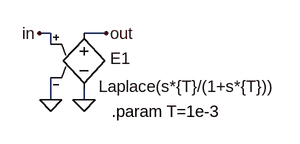
[diagram p0: schematic DifDelay.asc]
DifDelay.asc, the LTspice schematic file:
Version 4
SHEET 1 880 680
WIRE 112 144 96 144
WIRE 192 144 160 144
WIRE 112 160 112 144
WIRE 112 240 112 208
WIRE 160 240 160 224
FLAG 160 240 0
FLAG 192 144 out
FLAG 96 144 in
FLAG 112 240 0
SYMBOL e 160 128 R0
WINDOW 0 38 52 Left 0
WINDOW 3 21 92 Left 0
SYMATTR InstName E1
SYMATTR Value Laplace(s*{T}/(1+s*{T}))
TEXT 200 256 Left 0 !.param T=1e-3

The netlist it stands for:
* DifDelay.asc
E1 out 0 in 0 Laplace(s*{T}/(1+s*{T}))
.param T=1e-3
.backanno
.end